# EAGLE design MikroSumo (EAGLE 9.6.2)

## Sheet 1 of 2
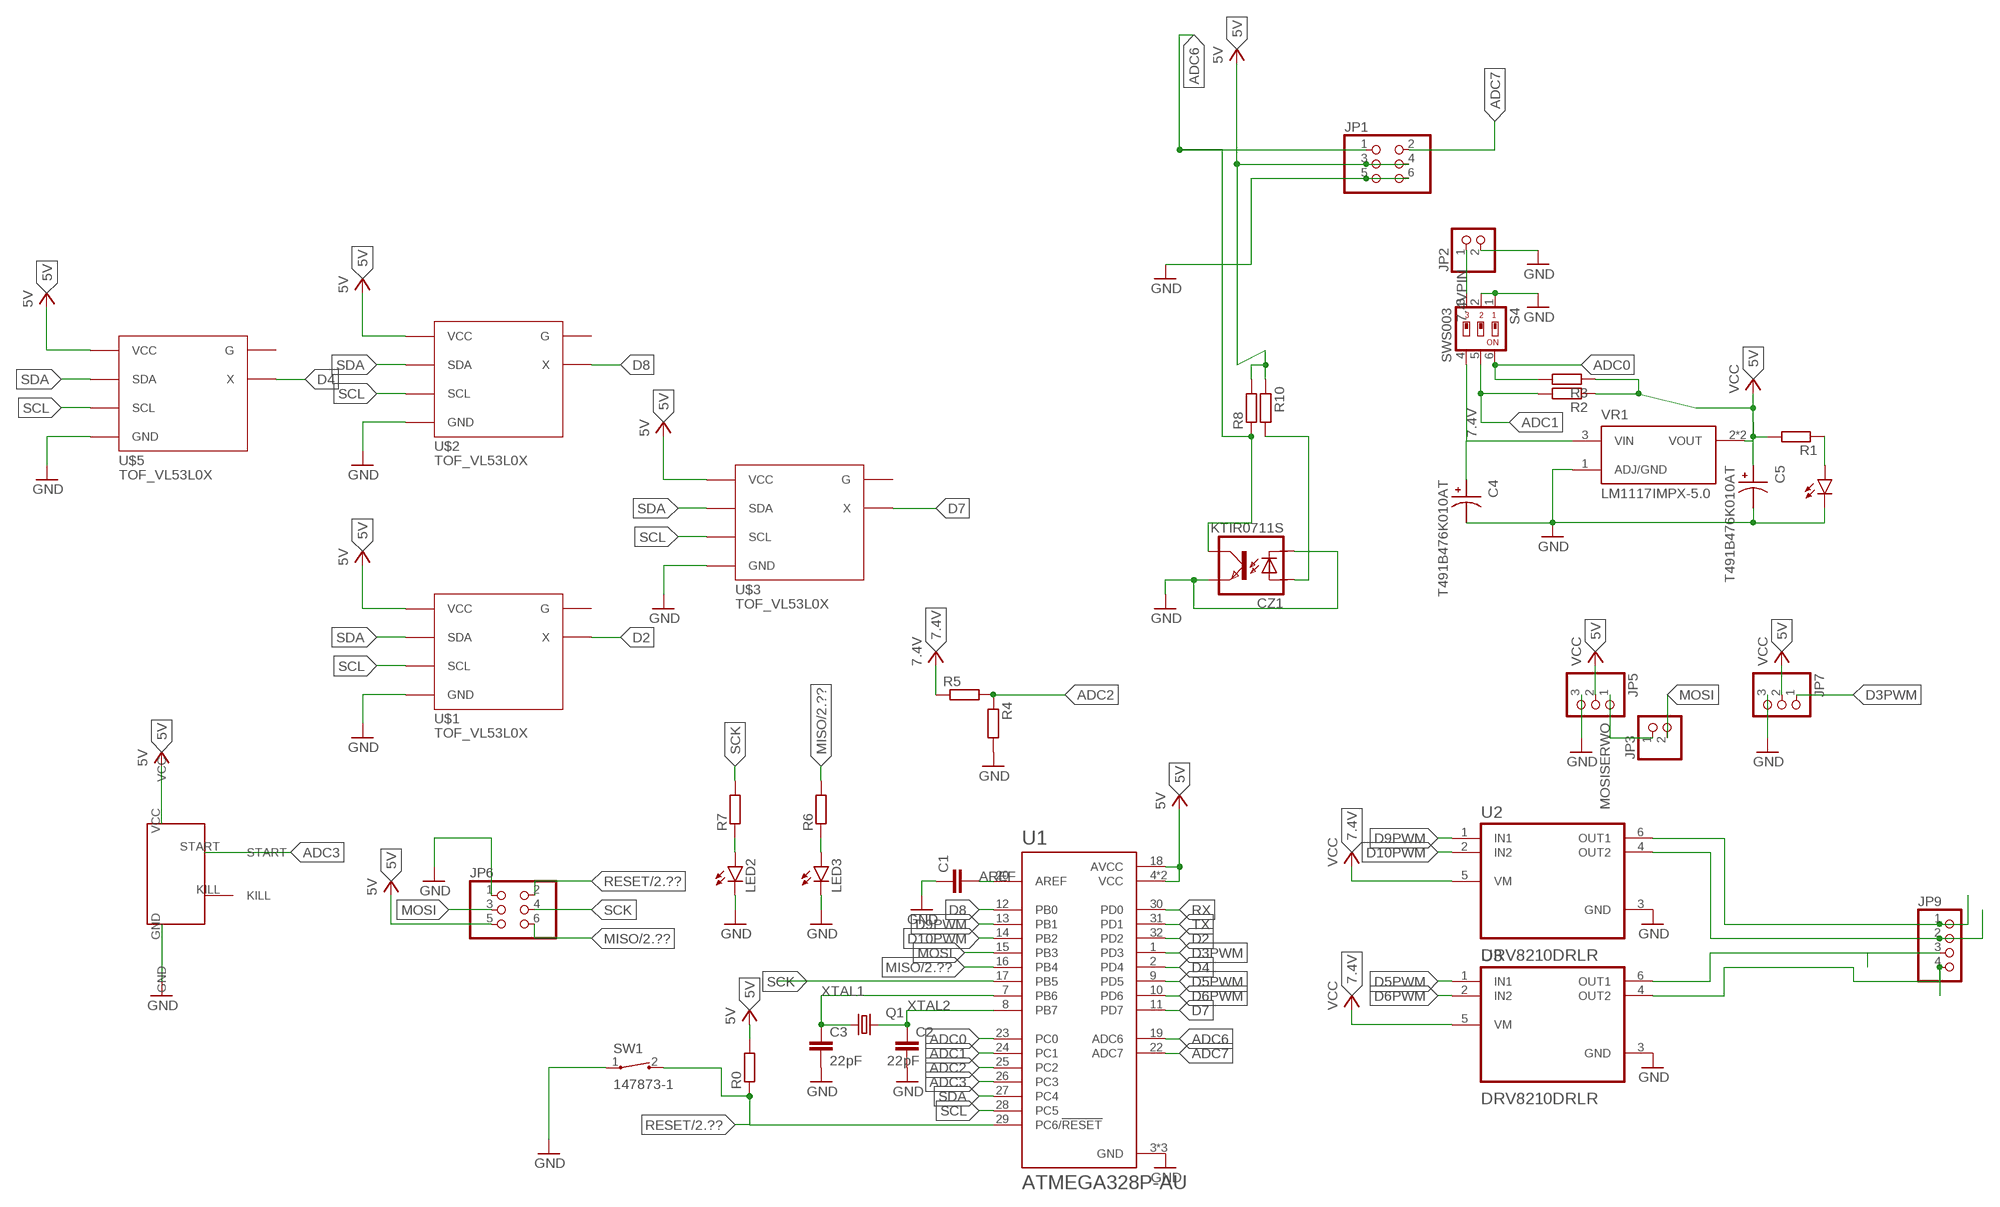
[diagram p0: schematic, sheet 1]

### Parts
C1  C-EUC0402  [C0402]
C2  22pF  C-EUC0402  [C0402]
C3  22pF  C-EUC0402  [C0402]
C4  T491B476K010AT  [CAPPM3528X210N]
C5  T491B476K010AT  [CAPPM3528X210N]
CZ1  KTIR0711S  [TOP]
JP1  PINHD-2X3  [2X03]
JP2  PINHD-1X2  [1X02]
JP3  PINHD-1X2  [1X02]
JP5  PINHD-1X3  [1X03]
JP6  PINHD-2X3  [2X03]
JP7  PINHD-1X3  [1X03]
JP9  PINHD-1X4/90  [1X04/90]
LED1  LEDCHIPLED_0603  [CHIPLED_0603]
LED2  LEDCHIPLED_0603  [CHIPLED_0603]
LED3  LEDCHIPLED_0603  [CHIPLED_0603]
Q1  KX-327-NHT  [3.2X1.5]
R0  R-EU_R0402  [R0402]
R1  R-EU_R0402  [R0402]
R2  R-EU_R0402  [R0402]
R3  R-EU_R0402  [R0402]
R4  R-EU_R0402  [R0402]
R5  R-EU_R0402  [R0402]
R6  R-EU_R0402  [R0402]
R7  R-EU_R0402  [R0402]
R8  R-EU_R0402  [R0402]
R10  R-EU_R0402  [R0402]
S4  SWS003  [SMS-003]
SW1  147873-1  [SW_147873-1]
U1  ATMEGA328P-AU  [QFP80P900X900X120-32N]
U2  DRV8210DRLR  [SOT50P160X60-6N]
U3  DRV8210DRLR  [SOT50P160X60-6N]
U$1  TOF_VL53L0X  [TOF_VL53L0X]
U$2  TOF_VL53L0X  [TOF_VL53L0X]
U$3  TOF_VL53L0X  [TOF_VL53L0X]
U$4  SUMO_START_MODULE  [SUMO_START_MODULE]
U$5  TOF_VL53L0X  [TOF_VL53L0X]
VR1  LM1117IMPX-5.0  [SOT230P700X180-4N]

### Nets
5V: C5.1 JP1.3 JP1.4 JP5.2 JP6.5 JP7.2 R0.2 R1.2 R2.1 R3.1 R8.2 R10.1 U1.4(VCC) U1.6(VCC) U1.18(AVCC) U$1.VCC U$1.VCC_(VCC) U$2.VCC U$2.VCC_(VCC) U$3.VCC U$3.VCC_(VCC) U$4.VCC U$5.VCC U$5.VCC_(VCC) VR1.2(VOUT) VR1.4(VOUT) ; supply symbol labelled VCC
7.4V: C4.1 R5.1 S4.4 U2.5(VM) U3.5(VM) VR1.3(VIN) ; supply symbol labelled VCC
7.4VPIN: JP2.1 S4.3
ADC0: R3.2 S4.6 U1.23(PC0)
ADC1: R2.2 S4.5 U1.24(PC1)
ADC2: R4.1 R5.2 U1.25(PC2)
ADC3: U1.26(PC3) U$4.START
ADC6: CZ1.KOLEKTOR JP1.1 R8.1 U1.19(ADC6)
ADC7: JP1.2 U1.22(ADC7)
AREF: C1.2 U1.20(AREF) ; also sheet 2
D2: U1.32(PD2) U$1.X
D3PWM: JP7.1 U1.1(PD3)
D4: U1.2(PD4) U$5.X
D5PWM: U1.9(PD5) U3.1(IN1)
D6PWM: U1.10(PD6) U3.2(IN2)
D7: U1.11(PD7) U$3.X
D8: U1.12(PB0) U$2.X
D9PWM: U1.13(PB1) U2.1(IN1)
D10PWM: U1.14(PB2) U2.2(IN2)
GND: C1.1 C2.2 C3.2 C4.2 C5.2 CZ1.EMITER CZ1.KATODA JP1.5 JP1.6 JP2.2 JP5.3 JP6.1 JP7.3 LED1.C LED2.C LED3.C R4.2 S4.1 S4.2 SW1.1 U1.3(GND) U1.5(GND) U1.21(GND) U2.3(GND) U3.3(GND) U$1.GND U$1.GND_(GND) U$2.GND U$2.GND_(GND) U$3.GND U$3.GND_(GND) U$4.GND U$5.GND U$5.GND_(GND) VR1.1(ADJ/GND) ; also sheet 2
MISO: JP6.6 R6.2 U1.16(PB4) ; also sheet 2
MOSI: JP3.2 JP6.3 U1.15(PB3)
MOSISERWO: JP3.1 JP5.1
N$1: JP9.1 U2.6(OUT1)
N$2: JP9.2 U2.4(OUT2)
N$3: JP9.3 U3.6(OUT1)
N$4: JP9.4 U3.4(OUT2)
N$5: LED1.A R1.1
N$9: LED3.A R6.1
N$10: LED2.A R7.1
N$11: CZ1.ANODA R10.2
RESET: JP6.2 R0.1 SW1.2 U1.29(PC6/!RESET) ; also sheet 2
RX: U1.30(PD0)
SCK: JP6.4 R7.2 U1.17(PB5)
SCL: U1.28(PC5) U$1.SCL U$1.SCL_(SCL) U$2.SCL U$2.SCL_(SCL) U$3.SCL U$3.SCL_(SCL) U$5.SCL U$5.SCL_(SCL)
SDA: U1.27(PC4) U$1.SDA U$1.SDA_(SDA) U$2.SDA U$2.SDA_(SDA) U$3.SDA U$3.SDA_(SDA) U$5.SDA U$5.SDA_(SDA)
TX: U1.31(PD1)
XTAL1: C3.1 Q1.1 U1.7(PB6)
XTAL2: C2.1 Q1.2 U1.8(PB7)
Unconnected: U$1.G U$2.G U$3.G U$4.KILL U$5.G

## Sheet 2 of 2
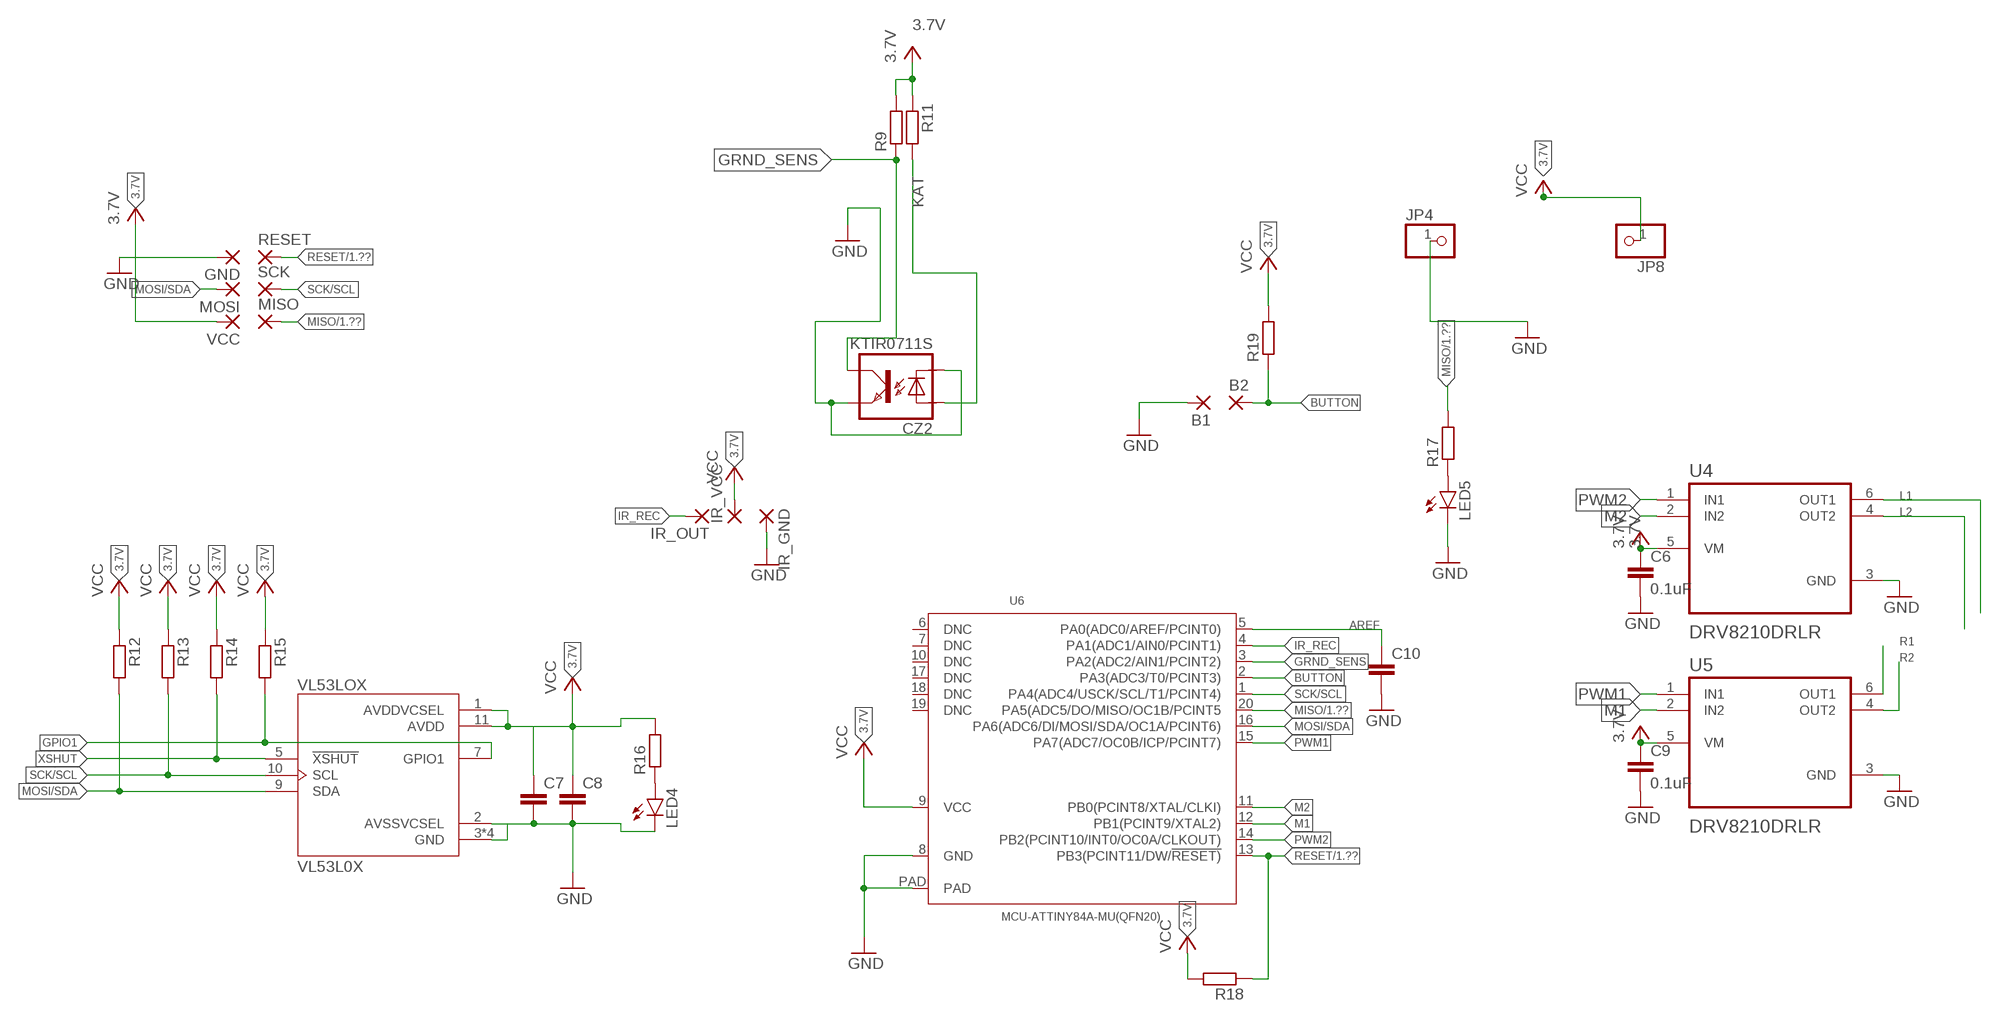
[diagram p1: schematic, sheet 2]

### Parts
B1  SMD2  [SMD1,27-2,54]
B2  SMD2  [SMD1,27-2,54]
C6  0.1uF  C-EUC0402  [C0402]
C7  C-EUC0402  [C0402]
C8  C-EUC0402  [C0402]
C9  0.1uF  C-EUC0402  [C0402]
C10  C-EUC0402  [C0402]
CZ2  KTIR0711S  [TOP]
GND  SMD2  [SMD1,27-2,54]
IR_GND  SMD2  [SMD1,27-2,54]
IR_OUT  SMD2  [SMD1,27-2,54]
IR_VCC  SMD2  [SMD1,27-2,54]
JP4  PINHD-1X1  [1X01]
JP8  PINHD-1X1  [1X01]
LED4  LEDCHIP-LED0603  [CHIP-LED0603]
LED5  LEDCHIP-LED0603  [CHIP-LED0603]
MISO  SMD2  [SMD1,27-2,54]
MOSI  SMD2  [SMD1,27-2,54]
R9  R-EU_R0402  [R0402]
R11  R-EU_R0402  [R0402]
R12  R-EU_R0402  [R0402]
R13  R-EU_R0402  [R0402]
R14  R-EU_R0402  [R0402]
R15  R-EU_R0402  [R0402]
R16  R-EU_R0402  [R0402]
R17  R-EU_R0402  [R0402]
R18  R-EU_R0402  [R0402]
R19  R-EU_R0402  [R0402]
RESET  SMD2  [SMD1,27-2,54]
SCK  SMD2  [SMD1,27-2,54]
U4  DRV8210DRLR  [SOT50P160X60-6N]
U5  DRV8210DRLR  [SOT50P160X60-6N]
U6  MCU-ATTINY84A-MU(QFN20)  [QFN20G-0.5-4X4MM]
VCC  SMD2  [SMD1,27-2,54]
VL53LOX  VL53L0X  [SENSOR_VL53L0X]

### Nets
3.7V: C6.1 C7.1 C8.1 C9.1 IR_VCC.1(P) JP8.1 R9.2 R11.1 R12.1 R13.1 R14.1 R15.1 R16.2 R18.2 R19.2 U4.5(VM) U5.5(VM) U6.9(VCC) VCC.1(P) VL53LOX.1(AVDDVCSEL) VL53LOX.11(AVDD) ; supply symbol labelled VCC
AREF: C10.1 U6.5(PA0(ADC0/AREF/PCINT0)) ; also sheet 1
BUTTON: B2.1(P) R19.1 U6.2(PA3(ADC3/T0/PCINT3))
GND: B1.1(P) C6.2 C7.2 C8.2 C9.2 C10.2 CZ2.EMITER CZ2.KATODA GND.1(P) IR_GND.1(P) JP4.1 LED4.C LED5.C U4.3(GND) U5.3(GND) U6.8(GND) U6.PAD VL53LOX.2(AVSSVCSEL) VL53LOX.3(GND) VL53LOX.4(GND) VL53LOX.6(GND) VL53LOX.12(GND) ; also sheet 1
GPIO1: R15.2 VL53LOX.7(GPIO1)
GRND_SENS: CZ2.KOLEKTOR R9.1 U6.3(PA2(ADC2/AIN1/PCINT2))
IR_REC: IR_OUT.1(P) U6.4(PA1(ADC1/AIN0/PCINT1))
KAT: CZ2.ANODA R11.2
L1: U4.6(OUT1)
L2: U4.4(OUT2)
M1: U5.2(IN2) U6.12(PB1(PCINT9/XTAL2))
M2: U4.2(IN2) U6.11(PB0(PCINT8/XTAL/CLKI))
MISO: MISO.1(P) R17.2 U6.20(PA5(ADC5/DO/MISO/OC1B/PCINT5) ; also sheet 1
MOSI/SDA: MOSI.1(P) R12.2 U6.16(PA6(ADC6/DI/MOSI/SDA/OC1A/PCINT6)) VL53LOX.9(SDA)
N$7: LED4.A R16.1
N$8: LED5.A R17.1
PWM1: U5.1(IN1) U6.15(PA7(ADC7/OC0B/ICP/PCINT7))
PWM2: U4.1(IN1) U6.14(PB2(PCINT10/INT0/OC0A/CLKOUT))
R1: U5.6(OUT1)
R2: U5.4(OUT2)
RESET: R18.1 RESET.1(P) U6.13(PB3(PCINT11/DW/!RESET)) ; also sheet 1
SCK/SCL: R13.2 SCK.1(P) U6.1(PA4(ADC4/USCK/SCL/T1/PCINT4)) VL53LOX.10(SCL)
XSHUT: R14.2 VL53LOX.5(!XSHUT)
Unconnected: U6.6(DNC) U6.7(DNC) U6.10(DNC) U6.17(DNC) U6.18(DNC) U6.19(DNC)

## Library data of the parts
B1 B2 GND IR_GND IR_OUT IR_VCC MISO MOSI RESET SCK VCC = wirepad:SMD2: SMD PAD
C1-C3 C6-C10 = rcl:C-EU: CAPACITOR, European symbol; SPICEPREFIX: C
C4 C5 = T491B476K010AT:T491B476K010AT: Cap Tant Solid 47uF 10V B CASE 10% (3.5 X 2.8 X 1.9mm) SMD 3528-21 1 Ohm 125C Automotive T/R Check availability <https://pricing.snapeda.com/parts/T491B476K010AT/KEMET/view-part?ref=eda>; AVAILABILITY: In Stock; DESCRIPTION: 47 µF Molded Tantalum Capacitors 10 V 1411 (3528 Metric) 1Ohm; MF: KEMET; MP: T491B476K010AT; PACKAGE: SMD-2 KEMET; PRICE: None; PURCHASE-URL: https://pricing.snapeda.com/search/part/T491B476K010AT/?ref=eda
CZ1 CZ2 = KTIR0711S:KTIR0711S
JP1 JP6 = pinhead:PINHD-2X3: PIN HEADER
JP2 JP3 = pinhead:PINHD-1X2: PIN HEADER
JP4 JP8 = pinhead:PINHD-1X1: PIN HEADER
JP5 JP7 = pinhead:PINHD-1X3: PIN HEADER
JP9 = pinhead:PINHD-1X4: PIN HEADER
LED1-LED5 = led:LED: LED OSRAM: - CHIPLED LG R971, LG N971, LY N971, LG Q971, LY Q971, LO R971, LY R971 LH N974, LH R974 LS Q976, LO Q976, LY Q976 LO Q996 - Hyper CHIPLED LW Q18S LB Q993, LB Q99A, LB R99A - SideLED LS A670, LO A670, LY A670, LG A670, LP A670 LB A673, LV A673, LT A673, LW A673 LH A674 LY A675 LS A676, LA A676, LO A676, LY A676, LW A676 LS A679, LY A679, LG A679 - Hyper Micro SIDELED® LS Y876, LA Y876, LO Y876, LY Y876 LT Y87S - SmartLED LW L88C, LW L88S LB L89C, LB L89S, LG L890 LS L89K, LO L89K, LY L89K LS L896, LA L896, LO L896, LY L896 - TOPLED LS T670, LO T670, LY T670, LG T670, LP T670 LSG T670, LSP T670, LSY T670, LOP T670, LYG T670 LG T671, LOG T671, LSG T671 LB T673, LV T673, LT T673, LW T673 LH T674 LS T676, LA T676, LO T676, LY T676, LB T676, LH T676, LSB T676, LW T676 LB T67C, LV T67C, LT T67C, LS T67K, LO T67K, LY T67K, LW E67C LS E67B, LA E67B, LO E67B, LY E67B, LB E67C, LV E67C, LT E67C LW T67C LS T679, LY T679, LG T679 LS T770, LO T770, LY T770, LG T770, LP T770 LB T773, LV T773, LT T773, LW T773 LH T774 LS E675, LA E675, LY E675, LS T675 LS T776, LA T776, LO T776, LY T776, LB T776 LHGB T686 LT T68C, LB T68C - Hyper Mini TOPLED® LB M676 - Mini TOPLED Santana® LG M470 LS M47K, LO M47K, LY M47K Source: http://www.osram.convergy.de LUXEON: - LUMILED® LXK2-PW12-R00, LXK2-PW12-S00, LXK2-PW14-U00, LXK2-PW14-V00 LXK2-PM12-R00, LXK2-PM12-S00, LXK2-PM14-U00 LXK2-PE12-Q00, LXK2-PE12-R00, LXK2-PE12-S00, LXK2-PE14-T00, LXK2-PE14-U00 LXK2-PB12-K00, LXK2-PB12-L00, LXK2-PB12-M00, LXK2-PB14-N00, LXK2-PB14-P00, LXK2-PB14-Q00 LXK2-PR12-L00, LXK2-PR12-M00, LXK2-PR14-Q00, LXK2-PR14-R00 LXK2-PD12-Q00, LXK2-PD12-R00, LXK2-PD12-S00 LXK2-PH12-R00, LXK2-PH12-S00 LXK2-PL12-P00, LXK2-PL12-Q00, LXK2-PL12-R00 Source: www.luxeon.com KINGBRIGHT: KA-3528ASYC Source: www.kingbright.com
Q1 = crystal-geyer_V1_0:KX-327: Tuning Fork Crystals (kHz) SMD: KX327 - Serie Model Size l/w/h [mm] Frequency Range Frequency Stability Temp. Range [°C] Load Capacitance AECQ 200 availabel Datasheet KX-327VT KX-327FT KX-327RT KX-327NHT KX-327NHF KX-327L KX-327S 1.25/1.05/0.5 1.6/1.0/0.5 2.0/1.2/0.6 3.2/1.5/0.8 3.2/1.5/0.8 7.0/1.5/1.4 8.2/3.8/2.5 32,768 kHz 32,768 kHz 32,768 kHz 32,768 kHz 32,768 kHz 32,768 kHz 32,768 kHz ±10 … ±20ppm ±10 … ±20ppm ±10 … ±20ppm ±10 … ±20ppm ±10 … ±20ppm ±10 … ±20ppm ±5 … ±20ppm (*) -40°C …+85°C (*) -40°C …+85°C (*) -40°C …+85°C (*) -40°C …+85°C (*) -40°C …+125°C (*) -40°C …+85°C (*) -40°C …+85°C 7/9/12,5 7/9/12,5 7/9/12,6 7/9/12,5 9/12,5 7/9/12,5 6/12,5 - - - - yes - - KX-327VT.pdf <http://www.geyer-electronic.de/uploads/tx_userartikelfrequenz/GEYER-KX-327VT.pdf> KX-327FT.pdf <http://www.geyer-electronic.de/uploads/tx_userartikelfrequenz/GEYER-KX-327FT.pdf> KX-327RT.pdf <http://www.geyer-electronic.de/uploads/tx_userartikelfrequenz/GEYER-KX-327RT.pdf> KX-327NHT.pdf <http://www.geyer-electronic.de/uploads/tx_userartikelfrequenz/GEYER-KX-327NHT.pdf> KX-327NHF.pdf <http://www.geyer-electronic.de/uploads/tx_userartikelfrequenz/GEYER-KX-327NHF.pdf> KX-327L.pdf <http://www.geyer-electronic.de/uploads/tx_userartikelfrequenz/GEYER-KX-327L.pdf> KX-327S.pdf <http://www.geyer-electronic.de/uploads/tx_userartikelfrequenz/GEYER-KX-327S.pdf> <http://www.geyer-electronic.de/fileadmin/template/img/logo-geyer-electronic.png> Details see: http://www.geyer-electronic.de/Frequenz-Produkte.9.0.html Created 2016-06-07, Hans Locher 2016 (C) Geyer Quartz Technology KX327VT,KX327FT,KX327RT,KX327NHT,KX327NHF,KX327S,KX327L;125105;1610;2012;3215;7015;8238;1,25x1,05,1.25x1.05;1,6x1,0,1.6x1.0;2,0x1,2,2.0x1.2;3,2x1,5,3.2x1.5;8,2x3,8,8.2x3.8,7.0x1.5,7,0x1,532.768kHz
R0 R1-R19 = rcl:R-EU_: RESISTOR, European symbol; SPICEPREFIX: R
S4 = smd-special:SWS003: SMD Dip Switch 3 pol.
SW1 = 147873-1:147873-1: Switch Tactile OFF (ON) SPST Rectangular Button J-Bend 0.05A 24VDC 1.77N SMD T/R Check availability <https://pricing.snapeda.com/parts/147873-1/TE%20Connectivity/view-part?ref=eda>; AVAILABILITY: In Stock; COMMENT: 147873-1; DESCRIPTION: Switch Tactile OFF (ON) SPST Rectangular Button J-Bend 0.05A 24VDC 1.77N SMD T/R; MF: TE Connectivity; MP: 147873-1; PACKAGE: None; PRICE: None; PURCHASE-URL: https://pricing.snapeda.com/search/part/147873-1/?ref=eda
U1 = ATMEGA328P-AU:ATMEGA328P-AU: ATmega Series 20 MHz 32 KB Flash 2 KB SRAM 8-Bit Microcontroller - TQFP-32 Check availability <https://pricing.snapeda.com/parts/ATMEGA328P-AU/Microchip%20Technology/view-part?ref=eda>; AVAILABILITY: In Stock; DESCRIPTION: AVR AVR® ATmega Microcontroller IC 8-Bit 20MHz 32KB (16K x 16) FLASH 32-TQFP (7x7); MF: Microchip Technology; MP: ATMEGA328P-AU; PACKAGE: TQFP-32 Microchip; PRICE: None; PURCHASE-URL: https://pricing.snapeda.com/search/part/ATMEGA328P-AU/?ref=eda
U2-U5 = DRV8210DRLR:DRV8210DRLR: None Check availability <https://pricing.snapeda.com/parts/DRV8210DRLR/Texas%20Instruments/view-part?ref=eda>; AVAILABILITY: In Stock; DESCRIPTION: 12-V, 1.76-A H-bridge motor driver with auto sleep mode; MF: Texas Instruments; MP: DRV8210DRLR; PACKAGE: SOT-563 Texas Instruments; PRICE: None; PURCHASE-URL: https://pricing.snapeda.com/search/part/DRV8210DRLR/?ref=eda
U6 = MCU-ATTINY84A-MU_QFN20_:MCU-ATTINY84A-MU(QFN20): 310010131 Check availability <https://pricing.snapeda.com/parts/ATTINY84A-MU/Microchip/view-part?ref=eda>; AVAILABILITY: In Stock; DESCRIPTION: AVR AVR® ATtiny Microcontroller IC 8-Bit 20MHz 8KB (4K x 16) FLASH 20-QFN-EP (4x4); MF: Microchip; MP: ATTINY84A-MU; PACKAGE: WFQFN-20 Atmel; PRICE: None; PURCHASE-URL: https://pricing.snapeda.com/search/part/ATTINY84A-MU/?ref=eda
U$1-U$3 U$5 = TOF_VL53L0X:TOF_VL53L0X
U$4 = SUMO_START_MODULE:SUMO_START_MODULE
VL53LOX = VL53L0X:VL53L0X: World smallest Time-of-Flight ranging and gesture detection sensor Check availability <https://pricing.snapeda.com/parts/VL53L0X/STMicroelectronics/view-part?ref=eda>; AVAILABILITY: Not in stock; DESCRIPTION: STM32F401RE, VL53L0X, mbed-Enabled Development series Light, 3D Time-of-Flight (ToF) Sensor Evaluation Board; MF: STMicroelectronics; MP: VL53L0X; PACKAGE: None; PRICE: None
VR1 = LM1117IMPX-5.0 (1):LM1117IMPX-5.0: FIXED POSITIVE LDO REGULATOR Check availability <https://pricing.snapeda.com/parts/LM1117IMPX-5.0/NOPB/Texas%20Instruments/view-part?ref=eda>; AVAILABILITY: In Stock; DESCRIPTION: 800-mA 15-V linear voltage regulator; MF: Texas Instruments; MP: LM1117IMPX-5.0/NOPB; PACKAGE: SOT-223-4 Texas Instruments; PRICE: None; PURCHASE-URL: https://pricing.snapeda.com/search/part/LM1117IMPX-5.0/NOPB/?ref=eda

## Board
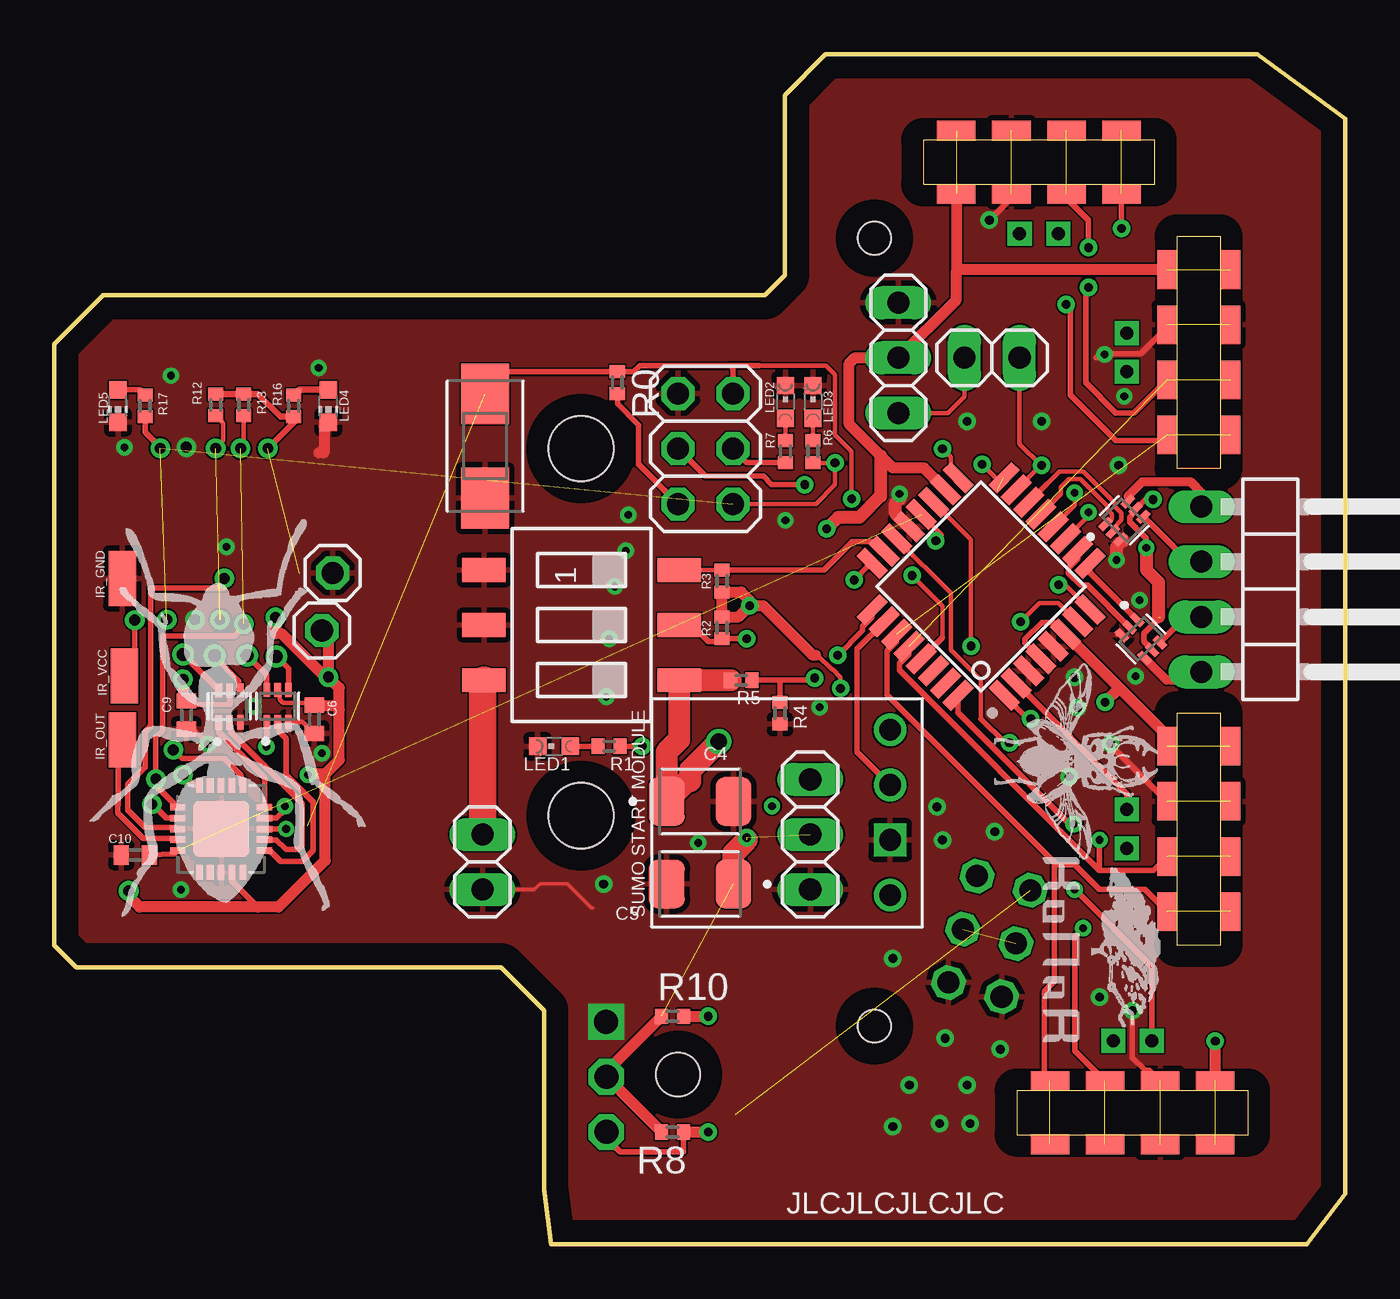
[diagram p2: board, top side]
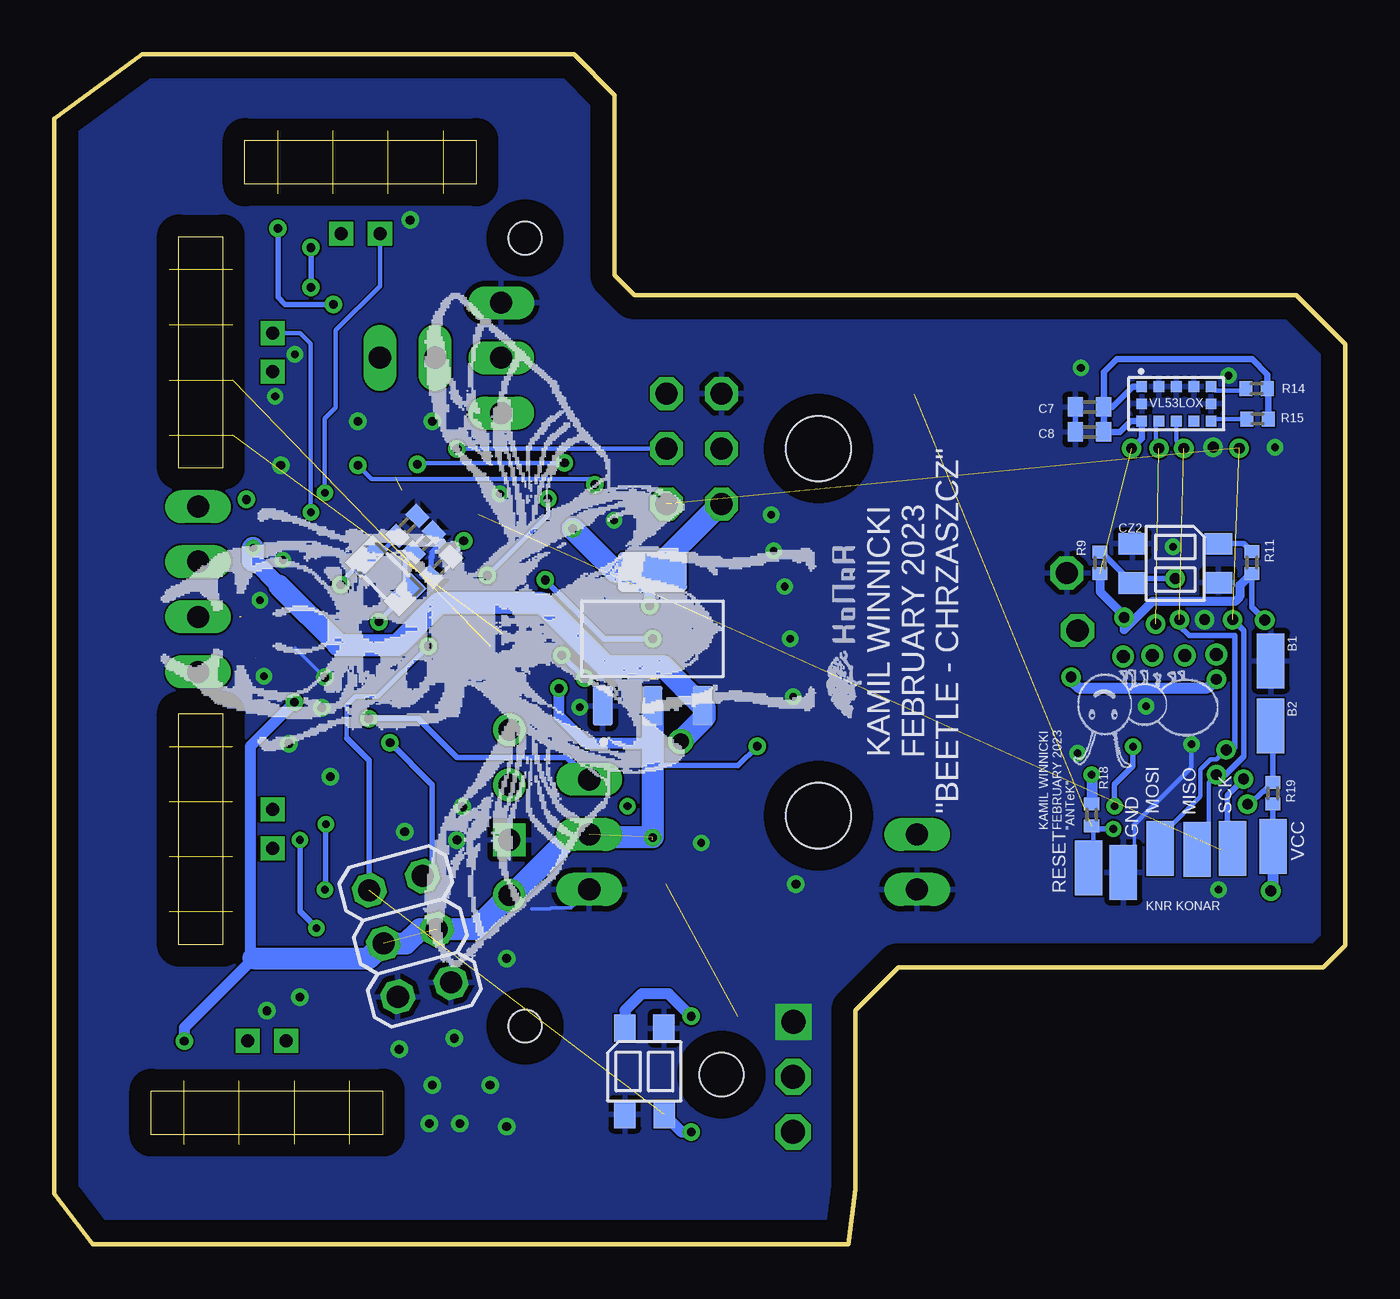
[diagram p3: board, bottom side, seen from below]

Size 59.51 x 54.86 mm. Coordinates in mm from the lower left corner, seen from the top.
Outline: 1.02,12.78 20.6,12.78 22.58,10.79 22.58,2.54 22.91,0 57.73,0 59.51,2.34 59.51,51.89 55.45,54.86 35.56,54.86 33.68,52.98 33.68,44.68 32.77,43.76 2.26,43.76 0,41.5 0,13.79 1.02,12.78
Copper layers (1*16): Top 0.035mm / dielectric 1.5mm / Bottom 0.035mm
Design rules "default *": minimum track width 6mil, minimum drill 0.35mm, track to track 3mil, track to pad 6mil, pad to pad 6mil, via to via 6mil, smd to smd 6mil, copper to edge 40mil, drill to drill 6mil, minimum pad ring 10mil, minimum via ring 8mil, stop-mask expansion 4mil, vias tented up to drill 0mil, thermal gap 10mil
Holes 3 mm at 24.29,36.68 24.29,19.77
Holes 1.5 mm at 37.81,10.06 37.81,46.39
Holes 2.01 mm at 28.75,7.82

### Footprints (pad centres in the part's own frame; a part is rotated, then mirrored left to right if it is on the bottom)
SMD1,27-2,54 = smd 1.27 x 2.54: 1 0,0
C0402 = smd 0.7 x 0.9: 1 -0.65,0; 2 0.65,0
CAPPM3528X210N = smd 1.64 x 2.23: 1 -1.54,0; 2 1.54,0
TOP = smd 1.27 x 1: ANODA -1.985,-0.9; EMITER -1.985,0.9; KATODA 1.985,-0.9; KOLEKTOR 1.985,0.91
2X03 = drill 1.016 octagon: 1 -2.54,-1.27; 2 -2.54,1.27; 3 0,-1.27; 4 0,1.27; 5 2.54,-1.27; 6 2.54,1.27
1X02 = drill 1.016 long: 1 -1.27,0; 2 1.27,0
1X01 = drill 1.016 octagon: 1 0,0
1X03 = drill 1.016 long: 1 -2.54,0; 2 0,0; 3 2.54,0
1X04/90 = drill 1.016 long: 1 -3.81,-3.81; 2 -1.27,-3.81; 3 1.27,-3.81; 4 3.81,-3.81
CHIPLED_0603 = smd 0.8 x 0.8: A 0,-0.75; C 0,0.75
CHIP-LED0603 = smd 0.8 x 0.8: A 0,-0.75; C 0,0.75
3.2X1.5 = smd 1 x 1.8: 1 -1.25,0; 2 1.25,0
R0402 = smd 0.6 x 0.7: 1 -0.5,0; 2 0.5,0
SMS-003 = smd 1.092 x 2.007: 1 -2.54,-4.496; 2 0,-4.496; 3 2.54,-4.496; 4 2.54,4.496; 5 0,4.496; 6 -2.54,4.496
SW_147873-1 = smd 2.8 x 2.2: 1 -2.4,0; 2 2.4,0
QFP80P900X900X120-32N = smd 1.5 x 0.55: 1 -4.3,2.8; 2 -4.3,2; 3 -4.3,1.2; 4 -4.3,0.4; 5 -4.3,-0.4; 6 -4.3,-1.2; 7 -4.3,-2; 8 -4.3,-2.8; 17 4.3,-2.8; 18 4.3,-2; 19 4.3,-1.2; 20 4.3,-0.4; 21 4.3,0.4; 22 4.3,1.2; 23 4.3,2; 24 4.3,2.8 | smd 0.55 x 1.5: 9 -2.8,-4.3; 10 -2,-4.3; 11 -1.2,-4.3; 12 -0.4,-4.3; 13 0.4,-4.3; 14 1.2,-4.3; 15 2,-4.3; 16 2.8,-4.3; 25 2.8,4.3; 26 2,4.3; 27 1.2,4.3; 28 0.4,4.3; 29 -0.4,4.3; 30 -1.2,4.3; 31 -2,4.3; 32 -2.8,4.3
SOT50P160X60-6N = smd 0.66 x 0.31: 1 -0.735,0.5; 2 -0.735,0; 3 -0.735,-0.5; 4 0.735,-0.5; 5 0.735,0; 6 0.735,0.5
QFN20G-0.5-4X4MM = smd 0.7 x 0.3: 1 -2,1; 2 -2,0.5; 3 -2,0; 4 -2,-0.5; 5 -2,-1; 11 2,-1; 12 2,-0.5; 13 2,0; 14 2,0.5; 15 2,1 | smd 0.3 x 0.7: 6 -1,-2; 7 -0.5,-2; 8 0,-2; 9 0.5,-2; 10 1,-2; 16 1,2; 17 0.5,2; 18 0,2; 19 -0.5,2; 20 -1,2 | smd 2.6 x 2.6: PAD 0,0
TOF_VL53L0X = drill 0.6 square: G 4.445,4.318; X 6.223,4.318 | smd 1.778 x 0.914: GND 6.604,-0.445; GND_ 6.604,2.477; SCL 4.064,-0.445; SCL_ 4.064,2.477; SDA 1.524,-0.445; SDA_ 1.524,2.477; VCC 9.144,-0.445; VCC_ 9.144,2.477
SUMO_START_MODULE = drill 1 square: GND 0,0 | drill 1: KILL 5.08,0; START 2.54,0; VCC -2.54,0
SENSOR_VL53L0X = smd 0.5 x 0.5: 1 -1.6,0.8; 2 -0.8,0.8; 3 0,0.8; 4 0.8,0.8; 5 1.6,0.8; 6 1.6,0; 7 1.6,-0.8; 8 0.8,-0.8; 9 0,-0.8; 10 -0.8,-0.8; 11 -1.6,-0.8; 12 -1.6,0
SOT230P700X180-4N = smd 1.84 x 0.93: 1 -3.085,2.3; 2 -3.085,0; 3 -3.085,-2.3 | smd 1.84 x 3.19: 4 3.085,0

### Placement (x,y rotation side)
B1  3.44,26.9 180 bottom
B2  3.44,23.9 0 bottom
C1  41.67,31.24 45 bottom
C2  43.23,33.12 45 bottom
C3  42.47,32.36 45 bottom
C4  29.77,20.42 0 top
C5  29.77,16.61 180 top
C6  11.99,24.2 270 top
C7  11.79,38.6 180 bottom
C8  11.79,37.45 180 bottom
C9  6.09,24.4 270 top
C10  3.74,17.95 180 top
CZ1  32.31,7.98 270 bottom
CZ2  7.84,31.4 180 bottom
GND  10.24,17.15 0 bottom
IR_GND  3.14,30.7 0 top
IR_OUT  3.14,23.25 0 top
IR_VCC  3.24,26.2 0 top
JP1  43.1,14.2 285 bottom
JP2  19.74,17.63 270 top
JP3  43.23,40.87 0 top
JP4  12.84,30.95 0 top
JP5  38.91,40.87 90 top
JP6  30.02,36.68 270 top
JP7  34.85,18.9 270 top
JP8  12.34,28.3 0 top
JP9  56.69,30.2 270 top
LED1  23.04,22.96 90 top
LED2  33.71,38.84 0 top
LED3  34.98,38.84 0 top
LED4  12.64,38.65 180 top
LED5  2.94,38.65 180 top
MISO  6.84,18.2 0 bottom
MOSI  8.54,18.25 0 bottom
Q1  44.22,30.83 135 bottom
R0  25.96,39.73 270 top
R1  25.58,22.96 0 top
R2  30.78,28.42 270 top
R3  30.78,30.58 90 top
R4  33.45,24.49 270 top
R5  31.67,26.01 0 top
R6  34.98,36.55 270 top
R7  33.71,36.55 270 top
R8  28.5,5.18 180 top
R9  11.31,31.42 270 bottom
R10  28.5,10.52 0 top
R11  4.31,31.43 90 bottom
R12  7.44,38.7 270 top
R13  8.74,38.7 270 top
R14  4.09,39.45 180 bottom
R15  4.04,38.05 180 bottom
R16  11.04,38.65 270 top
R17  4.19,38.65 270 top
R18  11.69,19.8 90 bottom
R19  3.34,20.8 270 bottom
RESET  11.84,17.35 0 bottom
S4  24.31,28.55 270 top
SCK  5.19,18.25 0 bottom
SW1  19.86,36.8 90 top
U1  42.72,30.33 135 top
U2  49.33,33.38 45 top
U3  50.09,27.91 315 top
U4  10.3,24.82 90 top
U5  8.08,24.8 90 top
U6  7.69,19.15 0 top
U$1  44.37,5.05 0 top
U$2  50.72,50.9 180 top
U$3  53.77,35.79 90 top
U$4  38.53,18.64 90 top
U$5  53.77,13.82 90 top
VCC  3.34,18.35 0 bottom
VL53LOX  7.79,38.75 0 bottom
VR1  31.93,27.91 90 bottom

### Tracks (layer width: path | path; a pad name or v marks a point on that pad's centre or on a via)
3.7V  (via drill 0.35, 0.5)  (1 unrouted)
  Top 0.2: 12.05,24.9 12.04,24.9 | U4.5 10.39,25.46 10.39,25.12 10.56,24.95 11.89,24.95
  Top 0.254: 10.31,25.54 U4.5 | C9.1 6.24,24.9 8.09,24.9 8.09,25.53 U5.5 | 11.89,24.95 C6.1 | U6.9 8.19,16.75 9.39,15.55 | v3.71,28.78 3.71,26.67 IR_VCC.1
  Top 0.305: R12.1 R13.1 9.39,39.2 10.44,38.15 R16.2 11.04,37.89 v9.85,36.7 | 12.04,24.9 C6.1 | 12.79,26.15 v12.64,26.15
  Top 0.508: v5.94,26.05 5.94,25.2 C9.1 | v12.64,26.15 12.49,26.15 10.49,28.15 10.2,28.15 v10.2,28.9 | v3.43,16.3 3.43,16.05 3.93,15.55 9.39,15.55 10.34,15.55 12.49,17.7 12.49,21.69 | v12.64,26.15 13.14,25.65 13.14,24.65 | v12.64,26.15 12.64,28 JP8.1 | 12.49,21.69 13.14,22.34 13.14,24.65 | C6.1 12.94,24.85 13.14,24.65 | 12.49,21.69 11.73,21.69 v11.69,21.65
  Bottom 0.2: VL53LOX.11 9.5,37.84 9.5,38 | 3.59,38.1 R15.1
  Bottom 0.254: VCC.1 R19.2 | R11.1 4.31,29.38 v3.71,28.78
  Bottom 0.305: C7.1 11.14,40.2 10.53,40.81 4.29,40.81 3.59,40.1 R14.1 3.54,39.4 R15.1 | v9.85,36.7 9.39,37.15 VL53LOX.11 9.89,37.95 10.39,37.45 C8.1 C7.1 | VL53LOX.1 9.79,39.55 10.74,38.6 C7.1
  Bottom 0.406: R11.1 4.86,30.38 4.86,29.85 5.07,29.64 8.88,29.64 10.2,28.33 v10.2,28.9 10.2,29 11.31,30.11 R9.2
  Bottom 0.508: v12.64,26.15 12.64,26 12.29,25.65 6.34,25.65 v5.94,26.05 | VCC.1 3.34,16.39 v3.43,16.3 | v11.69,21.65 R18.2
5V  (via drill 0.4, 1.1)  (9 unrouted)
  Top 0.2: v36.25,25.63 36.25,26.14 35.89,26.5 35.85,26.5 35.19,27.15 35.1,27.15
  Top 0.254: v27.1,22.96 R1.2 | JP6.5 26.93,35.96 26.93,37.78 25.96,38.75 R0.2 | U$5.VCC_ 51.29,23.45 | U1.4 44.75,27.73 44.75,27.91 45.52,28.68 46.07,28.68 U1.6
  Top 0.508: R8.2 v25.45,7.72 25.45,7.97 R10.1 | 51.29,23.45 49.03,25.72 | U1.6 49.03,25.72 | 49.03,25.72 49.03,25.59 v48.44,24.99 | U$1.VCC_ v53.52,9.37 | U$2.VCC_ 41.58,44.81 | 41.58,44.81 41.58,43.54 JP5.2 36.91,40.87 36.64,40.6 36.64,37.8 38.09,36.36 38.66,35.79 40.09,35.79 U1.18 | 41.58,44.81 41.71,44.93 U$3.VCC_ | 35.1,27.15 34.98,27.15 32.69,29.44 v32.05,29.44 | v32.05,29.44 31.54,28.92 R2.1 R3.1 31.67,30.08 32.05,29.69 v32.05,29.44
  Top 0.61: 38.09,36.36 38.09,34.49 37.11,33.51 36.13,33.51 v35.61,32.99
  Top 1.016: C5.1 31.31,18.03 31.93,18.65
  Bottom 0.254: v27.1,22.96 27.99,22.07 31.93,22.07 | 32.05,30.87 VR1.4
  Bottom 0.508: v48.44,24.99 50.47,22.96 50.47,13.33 50.32,13.19 53.52,9.99 v53.52,9.37 | 31.93,23.09 34.98,23.09 36.25,24.36 v36.25,25.63 | v32.05,29.44 32.05,30.87
  Bottom 1.016: VR1.2 31.93,23.09 31.93,22.07 31.93,18.77 34.72,18.77 JP7.2 35.61,18.9 38.4,16.1 U$4.VCC 40.11,14.53 42.65,14.53 43.31,13.87 JP1.3 45.01,13.19 50.32,13.19 | JP6.5 28.79,34.14 VR1.4 33.62,31 v35.61,32.99
  other vias: 31.93,18.75
7.4V  (via drill 0.35, 0.4, 0.75)  (1 unrouted)
  Top 0.254: 50.57,27.39 U3.5 50.22,27.79 50.22,28.17 50.98,28.93 | v50.66,34.34 50.29,34.34 U2.5 49.85,33.8 49.58,33.53 49.58,33.3 50.34,32.54 v50.34,32.11
  Top 0.61: v50.34,32.11 50.34,31.09 50.9,30.53 50.9,28.93
  Top 1.016: R5.1 S4.4 28.8,23.27 28.23,22.69 C4.1 29.16,21.35 29.33,21.35 29.33,21.88 v30.63,23.18
  Bottom 0.813: 49.14,30.36 50.3,31.52 50.34,31.52
  Bottom 1.016: 31.43,26.63 VR1.3 29.51,24.72 29.51,24.3 v30.63,23.18 | 31.43,26.63 31.44,26.64 | 31.43,26.63 34.07,26.63 37.01,29.57 41.79,29.57 43.74,27.61 46.39,27.61 | 46.39,27.61 46.43,27.61 | 50.34,31.52 v50.34,32.11 | 46.39,27.61 49.14,30.36
7.4VPIN
  Top 1.27: S4.3 19.74,25.93 JP2.1
ADC0
  Top 0.2: S4.6 R3.2
  Top 0.254: R3.2 32.44,31.08 32.57,31.08 35.48,31.08 36.79,32.39 37.83,32.39 U1.23
ADC1  (via drill 0.4)
  Top 0.254: S4.5 29.39,28.55 30.15,27.79 30.65,27.79 R2.2 v31.92,27.92 v31.93,27.91 | U1.24 37.52,31.39 37.52,31.26 v36.88,30.63
  Bottom 0.254: v31.93,27.91 34.17,27.91 v36.88,30.63
ADC2  (via drill 0.4)
  Top 0.254: R5.2 33.45,26.01 | 33.45,26.01 R4.1 | U1.25 37.7,28.92 37.26,28.48 37.26,28.3 v36.12,27.15 | v35.05,26.11 34.96,26.01 33.45,26.01
  Bottom 0.254: v36.12,27.15 35.07,26.11 v35.05,26.11
ADC3
  Top 0.254: U$4.START 37.01,22.71 37.01,27.44 U1.26
ADC6  (via drill 0.4, 1.1)  (1 unrouted)
  Top 0.2: U1.19 42.26,32.48 v42.26,27.58
  Top 0.254: v25.45,5.18 25.45,4.9 26.09,4.27 29.01,4.27 29.01,5.17 R8.1
  Top 0.508: R8.1 v30.15,5.18
  Bottom 0.2: v42.26,27.58 44.6,25.25 45.64,25.25 46.02,24.87 46.02,23.34
  Bottom 0.254: JP1.1 44.99,22.31 46.02,23.34
  Bottom 0.508: CZ1.KOLEKTOR 30.59,5.18 v30.15,5.18
ADC7  (via drill 0.4)
  Top 0.2: U1.22 41.33,30.03 41.33,27.41 42.72,26.01 42.72,24.23
  Top 0.254: 42.72,24.23 43.83,23.13 v44.03,23.13
  Bottom 0.254: v44.03,23.13 42.09,21.18 42.09,17.43 JP1.2
AREF  (via drill 0.4)  (1 unrouted)
  Top 0.2: U1.20 40.91,32.7 v40.64,32.43
  Top 0.254: C10.1 5.53,17.99 U6.5
  Bottom 0.2: C1.2 40.64,32.27 v40.64,32.43
BUTTON  (via drill 0.5)
  Top 0.254: U6.2 5.15,19.65 v4.51,20.29
  Bottom 0.254: B2.1 3.34,23.8 R19.1 3.76,20.88 3.8,20.88 4.39,20.29 v4.51,20.29
D2  (via drill 0.35)
  Top 0.254: U1.32 41.66,24.53 46.91,19.28 v47,19.36 | v47.04,16.36 50.6,12.8 U$1.X
  Bottom 0.254: v47,19.36 47,16.4 v47.04,16.36
D3PWM  (via drill 0.4)
  Top 0.254: U1.1 44.85,24.24 v45.02,24.24
  Bottom 0.254: JP7.1 35.86,22.45 40.94,22.45 42.73,24.24 v45.02,24.24
D4
  Top 0.254: U1.2 49.45,20.77 U$5.X
D5PWM
  Top 0.254: U3.1 47.74,30.97 U1.9
D6PWM
  Top 0.254: U1.10 47.18,31.61 46.74,31.17 46.74,30.94 47.29,30.38 47.62,30.38 U3.2
D7  (via drill 0.35)
  Top 0.2: U1.11 47.68,33.58 v47.68,33.76
  Bottom 0.2: v47.68,33.76 47.68,33.91 47.7,33.93 47.7,41.53 48.18,42.01 U$3.X
D8  (via drill 0.35)
  Top 0.2: U1.12 47.04,34.08 v47.04,34.65
  Bottom 0.2: v47.04,34.65 47.04,38.07 46.53,38.58 46.53,42.14 44.5,44.17 U$2.X
D9PWM
  Top 0.2: U1.13 46.41,34.58 46.41,34.91 46.78,35.28 47.3,35.28 48.54,34.03 48.54,33.87 48.76,33.66 48.76,33.44 48.57,33.25 48.49,33.25 U2.1
  Top 0.254: 48.43,33.21 U2.1
D10PWM
  Top 0.2: 45.72,35.03 46.33,35.63 47.45,35.63 48.9,34.18 48.9,34.02 49.2,33.72 49.2,33.38 48.81,32.99 U2.2
  Top 0.254: 45.72,35.03 U1.14
GND  (via drill 0.35, 0.4, 0.5, 1.1)  (4 unrouted)
  Top 0.152: JP2.2 22.15,16.36 22.4,16.61 23.67,16.61 24.77,15.52 24.82,15.52 | 48.98,28.08 U3.3
  Top 0.2: U4.3 11.45,24.09 C6.2 | C9.2 6.4,23.75 v7.09,23.06
  Top 0.254: U$1.GND_ 50.49,8.02 50.3,8.02 49.71,8.61 v49.71,10.77 | U$2.GND_ 44.12,48.23 v43.1,47.22 | U$3.GND_ 51.29,42.27 50.1,41.07 48.78,41.07 48.59,40.87 48.01,40.87 | U$5.GND_ 48.69,23.02 v48.69,23.09
  Top 0.508: LED4.C 12.44,37.7 12.44,36.5 12.19,36.5
  Top 0.61: v48.98,31.55 48.98,32.16 49.24,32.42 | v38.96,34.59 38.96,34.36 38.78,34.18 38.78,33.7 U1.21
  Bottom 0.152: v47.04,26.14 48.4,27.49 | JP7.3 35.69,15.52 36.61,15.52 36.66,15.47 37.52,15.47 | 9.73,17.66 9.73,19.36
  Bottom 0.2: GND.1 9.73,17.66 | v7.09,23.06 7.09,22 9.73,19.36
  Bottom 0.254: 42.14,30.79 C1.1 42.13,31.67 42.08,31.71 42.08,31.91 41.59,32.41 C3.2 42.14,32.69 | C8.2 C7.2
  other vias: 25.44,10.26 49.86,26.19 33.71,33.38 26.47,33.63 50.04,29.69 41.07,9.5 38.66,13.18 43.61,8.99 42.09,7.34 39.42,7.34 38.66,5.44 40.82,5.56 42.21,5.56 40.94,18.64 40.69,20.17 46.79,21.56 48.18,11.4 25.32,16.61 25.45,25.25 25.58,27.91 25.83,30.33 26.34,31.98 45.52,37.95 42.09,37.95 49.07,35.92 47.17,24.74 43.36,19.02 49.33,39.09 48.42,41.04 29.69,18.51 35.29,24.76 6.09,36.75 6.49,28.8 5.39,40.05 3.24,36.75 7.94,32.15 5.84,16.35 9.19,24.8 12.34,22.65 12.19,40.4
  pour Top: 22.12,10.92 22.12,0.1 23.32,-1.09 60.76,-1.09 60.76,52.63 58.14,55.24 32.68,55.24 31.06,43.92 1.93,43.92 -0.51,41.48 -0.51,13.72 2.29,10.92
  pour Bottom: 1.32,11.73 19.91,11.73 20.4,11.25 20.4,-1.6 57.63,-1.6 62.13,2.9 62.13,50.62 56.03,56.72 37.06,56.72 33.15,52.81 33.15,48.01 29.06,43.92 -0.25,43.92 -2.06,42.11 -2.06,13.16
GPIO1
  Bottom 0.2: R15.2 6.09,38.05 VL53LOX.7
GRND_SENS  (via drill 0.5)
  Top 0.254: U6.3 5.62,19.22 4.19,19.22 3.39,20.03 3.39,21.2 4.19,22 4.19,23.65 4.44,23.9 4.44,30.25 7.84,30.25 v7.84,30.7
  Bottom 0.254: R9.1 11.25,31.92 CZ2.KOLEKTOR 9.61,30.7 v7.84,30.7
IR_REC
  Top 0.254: U6.4 5.62,18.72 4.09,18.72 2.93,19.88 2.93,20.22 2.94,20.23 2.94,23.05 IR_OUT.1
KAT
  Bottom 0.254: R11.2 4.68,32.3 CZ2.ANODA
L1  (via drill 0.6)
  Top 0.254: U4.6 9.79,26.25 v8.89,27.15
L2  (via drill 0.6)
  Top 0.254: v10.24,27.1 10.8,26.54 U4.4
M1
  Top 0.2: 8.14,23.62 8.08,23.69 U5.2
  Top 0.254: U6.12 10.24,18.65 10.69,18.2 11.24,18.2 11.44,18.4 11.44,20.33 8.14,23.62
M2
  Top 0.254: U6.11 9.94,18.15 10.44,17.65 11.44,17.65 11.94,18.15 11.94,20.4 10.69,21.65 10.69,23.32 10.36,23.64 10.36,24.02 U4.2
MISO  (via drill 0.4, 0.5)  (3 unrouted)
  Top 0.2: R6.2 35,36.02 v35.99,36.02 35.99,35.03 35.1,34.14 JP6.6 | v42.77,35.97 43.48,35.25 43.48,34.77
  Top 0.254: 6.76,21.22 U6.20 6.44,21.15 v5.94,21.65 | R17.2 4.19,37.45 4.89,36.75 v4.89,36.7
  Bottom 0.2: 36.01,36.04 v35.99,36.02 42.72,36.02 v42.77,35.97 | MISO.1 6.79,18.2 6.29,18.7 6.29,21.3 v5.94,21.65
  Bottom 0.254: 6.74,18.3 MISO.1 | v5.94,21.65 5.54,21.65 4.69,22.5 4.69,28.3 v5.19,28.8
MOSI  (via drill 0.4)
  Top 0.2: U1.15 45.48,35.92 | 45.48,35.92 v45.52,35.92 | JP3.2 44.5,36.9 45.48,35.92
  Top 0.254: JP6.3 30.02,35.41 32.69,35.41 33.07,35.03 v34.59,35.03
  Bottom 0.2: v45.52,35.92 44.88,35.28 34.84,35.28 v34.59,35.03
MOSI/SDA  (via drill 0.5)  (1 unrouted)
  Top 0.2: v7.44,36.7 7.79,37.05 7.79,37.85 R12.2
  Top 0.254: U6.16 8.62,21.22 8.62,21.62 7.83,22.4 5.89,22.4 v5.49,22.8
  Bottom 0.2: VL53LOX.9 7.79,37.05 v7.44,36.7 | v5.49,22.8 5.93,22.36 6.23,22.36 6.69,21.9 6.69,20.65 8.44,18.9 8.44,18.35 MOSI.1
  Bottom 0.254: v5.49,22.8 5.19,22.8 5.09,22.9 5.09,28.07 7.19,28.07 7.64,28.52 v7.64,28.8
MOSISERWO
  Top 0.2: JP5.1 41.2,38.33 41.96,39.09 JP3.1
N$1
  Top 0.305: U2.6 49.49,34.49
  Top 0.406: 49.49,34.49 50.16,35.15 52.37,35.15 52.88,34.65 JP9.1
N$2
  Top 0.305: U2.4 52.27,31.47
  Top 0.406: 52.27,31.47 JP9.2
N$3
  Top 0.305: U3.6 52.14,28.93
  Top 0.406: 52.14,28.93 JP9.3
N$4  (1 unrouted)
  Top 0.406: JP9.4 52.5,26.01 51.49,26.01 51.29,26.01 51.27,26.01 U3.4
N$5
  Top 0.254: R1.1 LED1.A
N$6  (via drill 0.35)
  other vias: 33.09,20.21
N$7
  Top 0.305: R16.1 11.29,39.4 LED4.A
N$8
  Top 0.254: LED5.A 3.94,39.4 R17.1
N$9
  Top 0.2: LED3.A R6.1
N$10
  Top 0.2: R7.1 LED2.A
N$11  (via drill 0.4)
  Top 0.508: R10.2 v30.15,10.52
  Bottom 0.508: v30.15,10.52 31.19,11.56 32.44,11.56 33.21,10.79 CZ1.ANODA
PWM1
  Top 0.254: U5.1 7.58,23.61 9.69,21.5 U6.15
PWM2  (via drill 0.35)
  Top 0.254: U6.14 10.26,19.65 10.64,20.03 v10.64,20.2 | v9.79,22.95 9.79,24.08 U4.1
  Bottom 0.254: v10.64,20.2 10.64,21.2 9.79,22.05 v9.79,22.95
R1  (via drill 0.6)
  Top 0.254: v5.94,27.2 7.58,25.56 U5.6
R2  (via drill 0.6)
  Top 0.254: U5.4 8.51,25.6 8.51,25.98 7.39,27.11 v7.39,27.15
RESET  (via drill 0.35, 0.4)  (1 unrouted)
  Top 0.2: 40.94,27.98 40.94,29.44 v39.55,30.84 | 32.44,40.51 35.58,40.51 35.99,40.11 35.99,37.31 36.75,36.55 v36.75,34.37
  Top 0.254: 20.61,39.2 SW1.2 20.88,40.23 R0.1 26.71,40.23 27,40.51 31.17,40.51 | 31.17,40.51 31.29,40.39 JP6.2 | U1.29 40.94,27.98 | 32.5,40.51 32.44,40.51 31.17,40.51 | U6.13 v10.69,19.15
  Bottom 0.2: v36.75,34.37 36.75,33.63 v39.55,30.84 | RESET.1 11.61,17.58 11.61,19.23
  Bottom 0.254: R18.1 11.61,19.23 11.54,19.15 v10.69,19.15
SCK  (via drill 0.4)
  Top 0.2: U1.17 41.64,35.35 41.33,35.66 41.33,36.3 v40.94,36.68
  Top 0.254: R7.2 31.92,36.05 JP6.4
  Bottom 0.2: JP6.4 v40.94,36.68
SCK/SCL  (via drill 0.5)  (1 unrouted)
  Top 0.2: R13.2 8.74,36.85 v8.59,36.7
  Top 0.254: v8.74,28.6 8.74,28.5 8.29,28.05 4.99,28.05 4.99,23.7 4.69,23.4 v4.69,21.45 4.69,21.15 U6.1
  Bottom 0.2: v8.59,36.7 8.74,36.85 8.74,37.8 VL53LOX.10
  Bottom 0.254: v4.69,21.45 5.44,20.7 5.44,18.5 SCK.1
SCL  (via drill 0.35, 0.4)  (5 unrouted)
  Top 0.254: U$1.SCL_ 47.04,8.93 47.04,14.2 v47.42,14.58 | 51.29,17.82 U$5.SCL_ 50.66,17.25 48.18,17.25 | U1.28 39.4,27.22 38.96,26.78 38.96,26.47 48.18,17.25 | U$3.SCL_ 49.77,38.33 48.95,38.33 47.55,39.73 47.55,44 v47.68,44.12 | v47.68,45.95 47.68,47.22 46.66,48.23 U$2.SCL_ | v48.18,18.64 48.18,17.25
  Bottom 0.254: v47.68,44.12 v47.68,45.95 | v47.42,14.58 48.18,15.34 v48.18,18.64
SDA  (via drill 0.4)  (5 unrouted)
  Top 0.254: U1.27 38.83,27.79 38.39,27.35 38.39,25.32 46.11,17.61 46.11,17.5 | U$3.SDA_ 51.04,37.06 48.95,37.06 46.84,39.16 46.84,43.33 v46.64,43.33 | U$2.SDA_ v49.2,46.84 | 46.11,17.5 46.11,12.12 45.64,11.66 45.64,7.79 U$1.SDA_ | U$5.SDA_ 50.28,16.36 48.18,16.36 47.04,17.5 46.11,17.5
  Bottom 0.254: v46.64,43.33 48.86,43.33 49.2,43.66 v49.2,46.84
XSHUT
  Bottom 0.2: R14.2 4.69,39.35 5.99,39.35 VL53LOX.5
XTAL1  (via drill 0.4)
  Top 0.2: U1.7 47.14,28.7 46.28,29.57 45.41,29.57 v44.55,28.71
  Bottom 0.2: C3.1 43.34,31.49 Q1.1 43.34,29.92 v44.55,28.71
XTAL2  (via drill 0.4)
  Top 0.2: v46.3,30.41 46.6,30.41 U1.8
  Bottom 0.2: C2.1 44.64,31.72 Q1.2 46.3,30.52 v46.3,30.41

### Text on the board
tNames: JLCJLCJLCJLC
bNames: KAMIL WINNICKI / FEBRUARY 2023 / "BEETLE - CHRZASZCZ" | KAMIL WINNICKI / FEBRUARY 2023 / "ANTeK" | KNR KONAR